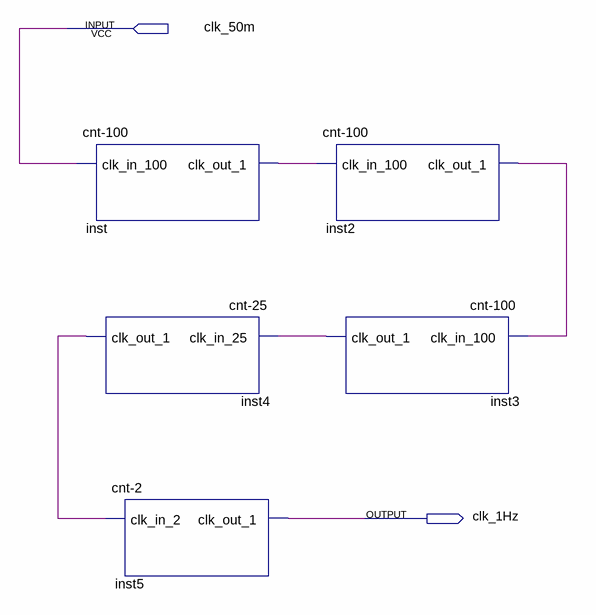
[diagram p0: schematic sheet]
// Quartus schematic mxh.bdf as structural Verilog: 5 symbols, 2 pins
module mxh (
  input  clk_50m,
  output clk_1Hz
);

  wire inst2_clk_out_1, inst3_clk_out_1, inst4_clk_out_1, inst_clk_out_1;

  \cnt-100  inst (.clk_in_100(clk_50m), .clk_out_1(inst_clk_out_1));
  \cnt-25  inst4 (.clk_in_25(inst3_clk_out_1), .clk_out_1(inst4_clk_out_1));
  \cnt-2  inst5 (.clk_in_2(inst4_clk_out_1), .clk_out_1(clk_1Hz));
  \cnt-100  inst2 (.clk_in_100(inst_clk_out_1), .clk_out_1(inst2_clk_out_1));
  \cnt-100  inst3 (.clk_in_100(inst2_clk_out_1), .clk_out_1(inst3_clk_out_1));
endmodule
